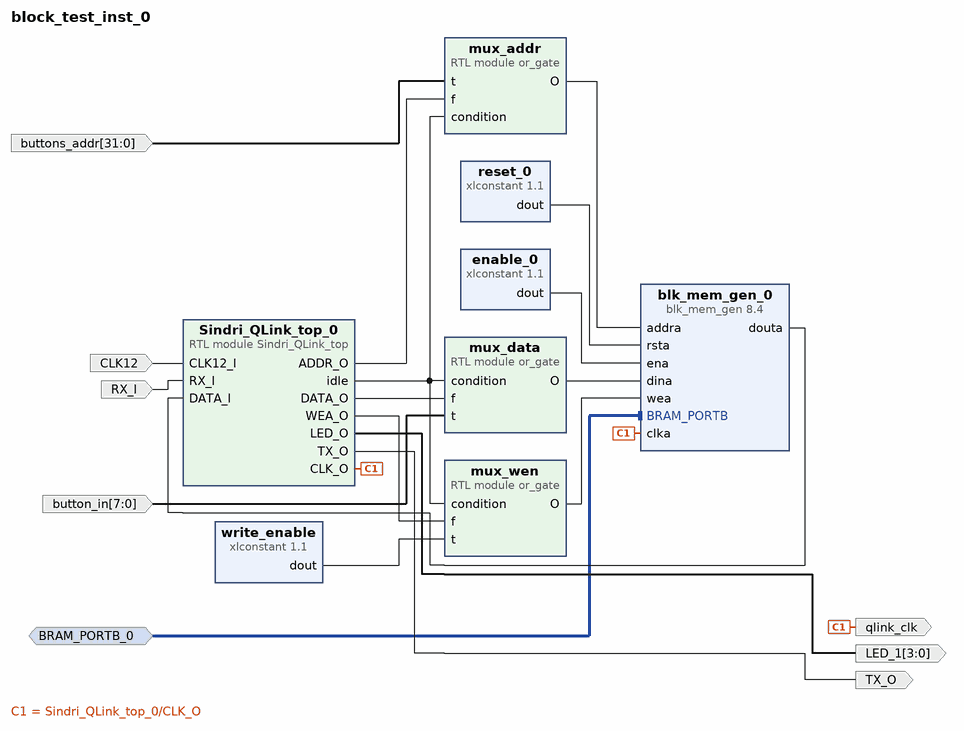
[diagram p0: block diagram of the top level]
# Vivado block design block_test_inst_0, xc7s15ftgb196-1, Vivado 2025.2
create_bd_design block_test_inst_0

create_bd_intf_port -mode Slave -vlnv xilinx.com:interface:bram_rtl:1.0 BRAM_PORTB_0
create_bd_port -dir I CLK12
create_bd_port -dir I RX_I
create_bd_port -dir O TX_O
create_bd_port -dir O -from 3 -to 0 LED_1
create_bd_port -dir I -from 7 -to 0 button_in
create_bd_port -dir I -from 31 -to 0 buttons_addr
create_bd_port -dir O qlink_clk

create_bd_cell -type module -reference Sindri_QLink_top Sindri_QLink_top_0
create_bd_cell -type ip -vlnv xilinx.com:ip:blk_mem_gen:8.4 blk_mem_gen_0
set_property -dict [list \
  CONFIG.CTRL_ECC_ALGO NONE \
  CONFIG.Enable_32bit_Address true \
  CONFIG.Memory_Type True_Dual_Port_RAM \
  CONFIG.Read_Width_A 32 \
  CONFIG.Read_Width_B 32 \
  CONFIG.Write_Width_A 32 \
  CONFIG.Write_Width_B 32 \
] [get_bd_cells blk_mem_gen_0]
create_bd_cell -type ip -vlnv xilinx.com:ip:xlconstant:1.1 enable_0
create_bd_cell -type ip -vlnv xilinx.com:ip:xlconstant:1.1 reset_0
set_property -dict {CONFIG.CONST_VAL 0} [get_bd_cells reset_0]
create_bd_cell -type ip -vlnv xilinx.com:ip:xlconstant:1.1 write_enable
set_property -dict {CONFIG.CONST_VAL b1111 CONFIG.CONST_WIDTH 4} [get_bd_cells write_enable]
create_bd_cell -type module -reference or_gate mux_addr
create_bd_cell -type module -reference or_gate mux_data
create_bd_cell -type module -reference or_gate mux_wen
set_property -dict {CONFIG.width 4} [get_bd_cells mux_wen]

# ---- connections ----

connect_bd_intf_net -intf_net BRAM_PORTB_0_1 [get_bd_intf_ports BRAM_PORTB_0] [get_bd_intf_pins blk_mem_gen_0/BRAM_PORTB]
connect_bd_net -net CLK12_I_1 [get_bd_ports CLK12] [get_bd_pins Sindri_QLink_top_0/CLK12_I]
connect_bd_net [get_bd_pins Sindri_QLink_top_0/ADDR_O] [get_bd_pins mux_addr/f]
connect_bd_net -net RX_I_0_1 [get_bd_ports RX_I] [get_bd_pins Sindri_QLink_top_0/RX_I]
connect_bd_net [get_bd_pins Sindri_QLink_top_0/CLK_O] [get_bd_pins blk_mem_gen_0/clka] [get_bd_ports qlink_clk]
connect_bd_net [get_bd_pins Sindri_QLink_top_0/DATA_O] [get_bd_pins mux_data/f]
connect_bd_net [get_bd_pins Sindri_QLink_top_0/LED_O] [get_bd_ports LED_1]
connect_bd_net [get_bd_pins Sindri_QLink_top_0/TX_O] [get_bd_ports TX_O]
connect_bd_net [get_bd_pins Sindri_QLink_top_0/WEA_O] [get_bd_pins mux_wen/f]
connect_bd_net [get_bd_pins Sindri_QLink_top_0/idle] [get_bd_pins mux_addr/condition] [get_bd_pins mux_data/condition] [get_bd_pins mux_wen/condition]
connect_bd_net -net addrb_0_1 [get_bd_ports buttons_addr] [get_bd_pins mux_addr/t]
connect_bd_net [get_bd_pins blk_mem_gen_0/douta] [get_bd_pins Sindri_QLink_top_0/DATA_I]
connect_bd_net -net dinb_0_1 [get_bd_ports button_in] [get_bd_pins mux_data/t]
connect_bd_net -net enable_1_dout [get_bd_pins reset_0/dout] [get_bd_pins blk_mem_gen_0/rsta]
connect_bd_net -net or_gate_0_O [get_bd_pins mux_addr/O] [get_bd_pins blk_mem_gen_0/addra]
connect_bd_net -net or_gate_1_O [get_bd_pins mux_data/O] [get_bd_pins blk_mem_gen_0/dina]
connect_bd_net -net or_gate_2_O [get_bd_pins mux_wen/O] [get_bd_pins blk_mem_gen_0/wea]
connect_bd_net [get_bd_pins write_enable/dout] [get_bd_pins mux_wen/t]
connect_bd_net -net xlconstant_0_dout [get_bd_pins enable_0/dout] [get_bd_pins blk_mem_gen_0/ena]

validate_bd_design
save_bd_design
